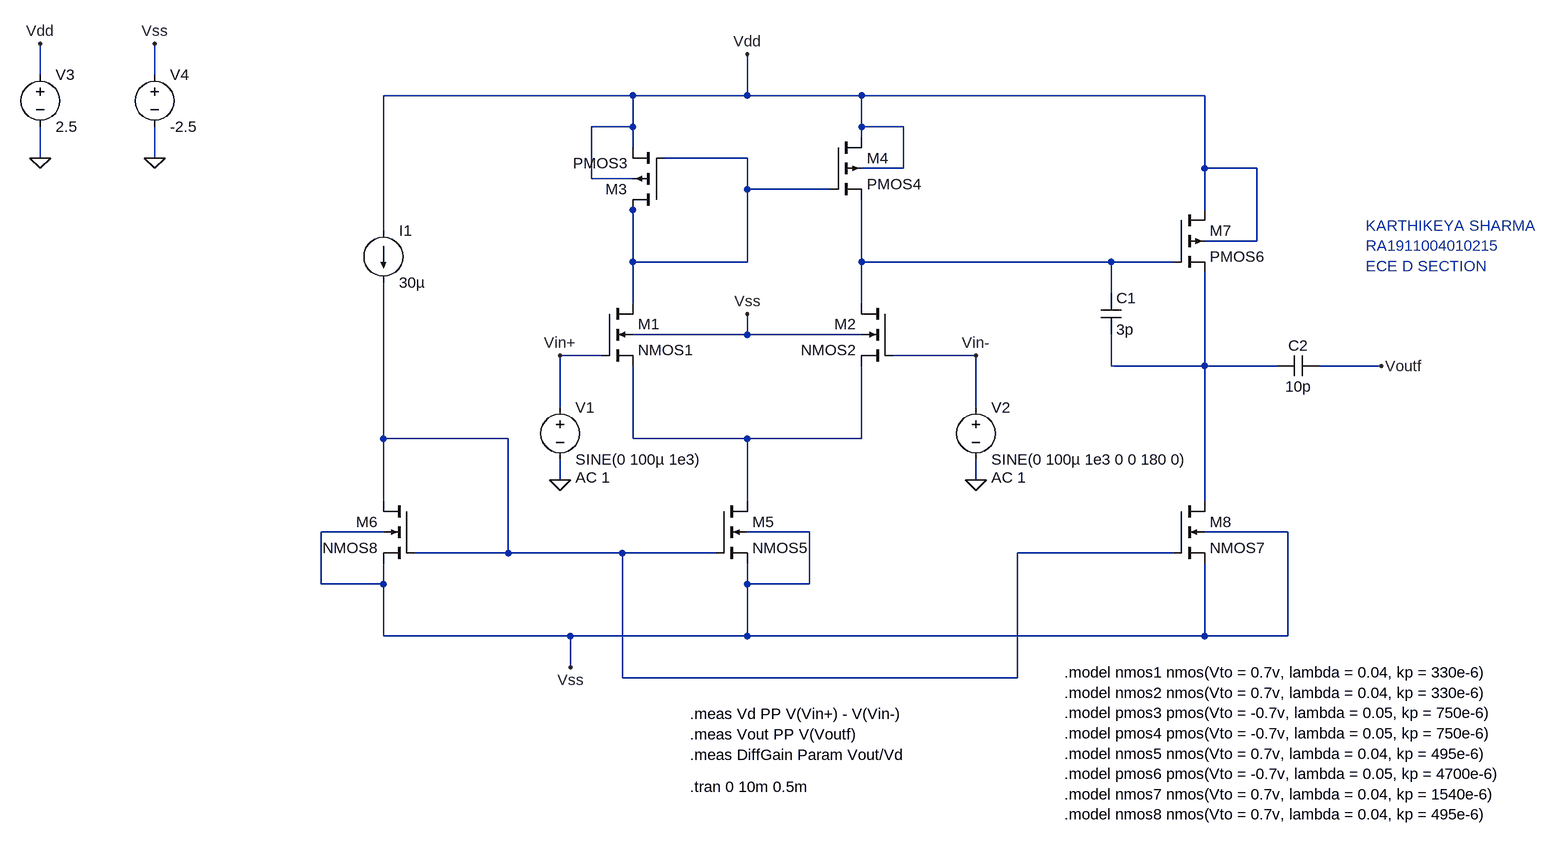
[diagram p0: schematic two-stage_opamp.asc]
two-stage_opamp.asc, the LTspice schematic file:
Version 4
SHEET 1 1652 1056
WIRE -672 -96 -672 -144
WIRE -496 -96 -496 -144
WIRE 240 -64 -144 -64
WIRE 416 -64 416 -128
WIRE 416 -64 240 -64
WIRE 592 -64 416 -64
WIRE 1120 -64 592 -64
WIRE 240 -16 240 -64
WIRE 240 -16 176 -16
WIRE 592 -16 592 -64
WIRE 656 -16 592 -16
WIRE 592 0 592 -16
WIRE 240 16 240 -16
WIRE -672 32 -672 -16
WIRE -496 32 -496 -16
WIRE 416 32 288 32
WIRE 656 48 656 -16
WIRE 656 48 592 48
WIRE 1120 48 1120 -64
WIRE 1200 48 1120 48
WIRE 176 64 176 -16
WIRE 240 64 176 64
WIRE 416 80 416 32
WIRE 544 80 416 80
WIRE 240 112 240 96
WIRE 1120 112 1120 48
WIRE -144 144 -144 -64
WIRE 1200 160 1200 48
WIRE 1200 160 1120 160
WIRE 240 192 240 112
WIRE 416 192 416 80
WIRE 416 192 240 192
WIRE 592 192 592 96
WIRE 976 192 592 192
WIRE 1072 192 976 192
WIRE 976 240 976 192
WIRE 240 256 240 192
WIRE 592 256 592 192
WIRE 416 304 416 272
WIRE 416 304 240 304
WIRE 592 304 416 304
WIRE 192 336 128 336
WIRE 768 336 640 336
WIRE 976 352 976 304
WIRE 1120 352 1120 208
WIRE 1120 352 976 352
WIRE 1232 352 1120 352
WIRE 1392 352 1296 352
WIRE 128 416 128 336
WIRE 768 416 768 336
WIRE -144 464 -144 224
WIRE 48 464 -144 464
WIRE 240 464 240 352
WIRE 416 464 240 464
WIRE 592 464 592 352
WIRE 592 464 416 464
WIRE 128 528 128 496
WIRE 768 528 768 496
WIRE -144 560 -144 464
WIRE 416 560 416 464
WIRE 1120 560 1120 352
WIRE -144 608 -240 608
WIRE 512 608 416 608
WIRE 1248 608 1120 608
WIRE 48 640 48 464
WIRE 48 640 -96 640
WIRE 224 640 48 640
WIRE 368 640 224 640
WIRE 1072 640 832 640
WIRE -240 688 -240 608
WIRE -144 688 -144 656
WIRE -144 688 -240 688
WIRE 416 688 416 656
WIRE 512 688 512 608
WIRE 512 688 416 688
WIRE -144 768 -144 688
WIRE 144 768 -144 768
WIRE 416 768 416 688
WIRE 416 768 144 768
WIRE 1120 768 1120 656
WIRE 1120 768 416 768
WIRE 1248 768 1248 608
WIRE 1248 768 1120 768
WIRE 144 816 144 768
WIRE 224 832 224 640
WIRE 832 832 832 640
WIRE 832 832 224 832
FLAG 128 528 0
FLAG 768 528 0
FLAG 416 -128 Vdd
FLAG 416 272 Vss
FLAG 144 816 Vss
FLAG 1392 352 Voutf
FLAG -672 32 0
FLAG -496 32 0
FLAG -672 -144 Vdd
FLAG -496 -144 Vss
FLAG 128 336 Vin+
FLAG 768 336 Vin-
SYMBOL nmos4 192 256 R0
SYMATTR InstName M1
SYMATTR Value NMOS1
SYMBOL nmos4 640 256 M0
SYMATTR InstName M2
SYMATTR Value NMOS2
SYMBOL pmos4 288 112 R180
SYMATTR InstName M3
SYMATTR Value PMOS3
SYMBOL pmos4 544 0 R0
SYMATTR InstName M4
SYMATTR Value PMOS4
SYMBOL nmos4 368 560 R0
SYMATTR InstName M5
SYMATTR Value NMOS5
SYMBOL nmos4 -96 560 M0
SYMATTR InstName M6
SYMATTR Value NMOS8
SYMBOL current -144 144 R0
WINDOW 123 0 0 Left 0
WINDOW 39 0 0 Left 0
SYMATTR InstName I1
SYMATTR Value 30µ
SYMBOL voltage 128 400 R0
WINDOW 123 24 124 Left 2
WINDOW 39 0 0 Left 0
SYMATTR Value2 AC 1
SYMATTR InstName V1
SYMATTR Value SINE(0 100µ 1e3)
SYMBOL voltage 768 400 R0
WINDOW 123 24 124 Left 2
WINDOW 39 0 0 Left 0
SYMATTR Value2 AC 1
SYMATTR InstName V2
SYMATTR Value SINE(0 100µ 1e3 0 0 180 0)
SYMBOL pmos4 1072 112 R0
SYMATTR InstName M7
SYMATTR Value PMOS6
SYMBOL nmos4 1072 560 R0
SYMATTR InstName M8
SYMATTR Value NMOS7
SYMBOL cap 960 240 R0
SYMATTR InstName C1
SYMATTR Value 3p
SYMBOL cap 1232 368 R270
WINDOW 0 32 32 VTop 2
WINDOW 3 0 32 VBottom 2
SYMATTR InstName C2
SYMATTR Value 10p
SYMBOL voltage -672 -112 R0
WINDOW 123 0 0 Left 0
WINDOW 39 0 0 Left 0
SYMATTR InstName V3
SYMATTR Value 2.5
SYMBOL voltage -496 -112 R0
WINDOW 123 0 0 Left 0
WINDOW 39 0 0 Left 0
SYMATTR InstName V4
SYMATTR Value -2.5
TEXT 904 824 Left 2 !.model nmos1 nmos(Vto = 0.7v, lambda = 0.04, kp = 330e-6)\n.model nmos2 nmos(Vto = 0.7v, lambda = 0.04, kp = 330e-6)\n.model pmos3 pmos(Vto = -0.7v, lambda = 0.05, kp = 750e-6)\n.model pmos4 pmos(Vto = -0.7v, lambda = 0.05, kp = 750e-6)\n.model nmos5 nmos(Vto = 0.7v, lambda = 0.04, kp = 495e-6)\n.model pmos6 pmos(Vto = -0.7v, lambda = 0.05, kp = 4700e-6)\n.model nmos7 nmos(Vto = 0.7v, lambda = 0.04, kp = 1540e-6)\n.model nmos8 nmos(Vto = 0.7v, lambda = 0.04, kp = 495e-6)
TEXT 328 888 Left 2 !.meas Vd PP V(Vin+) - V(Vin-)\n.meas Vout PP V(Voutf)\n.meas DiffGain Param Vout/Vd
TEXT 328 1000 Left 2 !.tran 0 10m 0.5m
TEXT 1368 136 Left 2 ;KARTHIKEYA SHARMA\nRA1911004010215\nECE D SECTION

The netlist it stands for:
* two-stage_opamp.asc
M1 N001 Vin+ N005 Vss NMOS1
M2 N002 Vin- N005 Vss NMOS2
M3 N001 N001 Vdd Vdd PMOS3
M4 Vdd N001 N002 Vdd PMOS4
M5 N005 N004 Vss Vss NMOS5
M6 N004 N004 Vss Vss NMOS8
I1 Vdd N004 30µ
V1 Vin+ 0 SINE(0 100µ 1e3) AC 1
V2 Vin- 0 SINE(0 100µ 1e3 0 0 180 0) AC 1
M7 Vdd N002 N003 Vdd PMOS6
M8 N003 N004 Vss Vss NMOS7
C1 N002 N003 3p
C2 N003 Voutf 10p
V3 Vdd 0 2.5
V4 Vss 0 -2.5
.model NMOS NMOS
.model PMOS PMOS
.lib standard.mos
.model nmos1 nmos(Vto = 0.7v, lambda = 0.04, kp = 330e-6)
.model nmos2 nmos(Vto = 0.7v, lambda = 0.04, kp = 330e-6)
.model pmos3 pmos(Vto = -0.7v, lambda = 0.05, kp = 750e-6)
.model pmos4 pmos(Vto = -0.7v, lambda = 0.05, kp = 750e-6)
.model nmos5 nmos(Vto = 0.7v, lambda = 0.04, kp = 495e-6)
.model pmos6 pmos(Vto = -0.7v, lambda = 0.05, kp = 4700e-6)
.model nmos7 nmos(Vto = 0.7v, lambda = 0.04, kp = 1540e-6)
.model nmos8 nmos(Vto = 0.7v, lambda = 0.04, kp = 495e-6)
.meas Vd PP V(Vin+) - V(Vin-)
.meas Vout PP V(Voutf)
.meas DiffGain Param Vout/Vd
.tran 0 10m 0.5m
* KARTHIKEYA SHARMA
* RA1911004010215
* ECE D SECTION
.backanno
.end